# Altium schematic sheet 2XSFP_Arria10.SchDoc: 2 x SFP
size B; DocumentNumber: 18; SheetNumber: 18; SheetTotal: 46
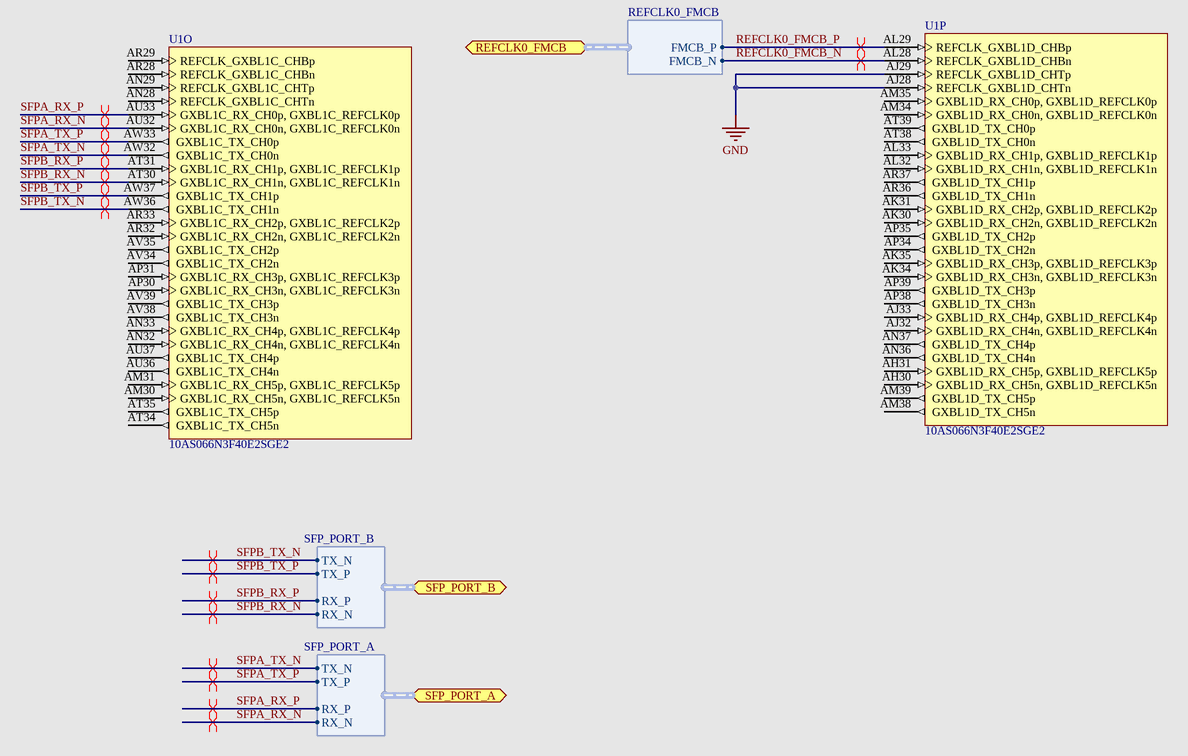
[diagram p0: 2XSFP_Arria10.SchDoc]

## Parts
U1  10AS066N3F40E2SGE2  [ALTR-FBGA1517_A-350]  (parts O,P of 31)

## Ports
REFCLK0_FMCB (harness REFCLK0_FMCB), SFP_PORT_A (harness SFP_PORT_A), SFP_PORT_B (harness SFP_PORT_B)

## Harnesses
REFCLK0_FMCB: FMCB_P, FMCB_N
SFP_PORT_B: TX_P, TX_N, RX_P, RX_N
SFP_PORT_A: TX_P, TX_N, RX_P, RX_N

## Nets
GND: U1.AJ28(REFCLK_GXBL1D_CHTn) U1.AJ29(REFCLK_GXBL1D_CHTp)
REFCLK0_FMCB_N: U1.AL28(REFCLK_GXBL1D_CHBn) ; port REFCLK0_FMCB.FMCB_N
REFCLK0_FMCB_P: U1.AL29(REFCLK_GXBL1D_CHBp) ; port REFCLK0_FMCB.FMCB_P
SFPA_RX_N: U1.AU32(GXBL1C_RX_CH0n,_GXBL1C_REFCLK0n) ; port SFP_PORT_A.RX_N
SFPA_RX_P: U1.AU33(GXBL1C_RX_CH0p,_GXBL1C_REFCLK0p) ; port SFP_PORT_A.RX_P
SFPA_TX_N: U1.AW32(GXBL1C_TX_CH0n) ; port SFP_PORT_A.TX_N
SFPA_TX_P: U1.AW33(GXBL1C_TX_CH0p) ; port SFP_PORT_A.TX_P
SFPB_RX_N: U1.AT30(GXBL1C_RX_CH1n,_GXBL1C_REFCLK1n) ; port SFP_PORT_B.RX_N
SFPB_RX_P: U1.AT31(GXBL1C_RX_CH1p,_GXBL1C_REFCLK1p) ; port SFP_PORT_B.RX_P
SFPB_TX_N: U1.AW36(GXBL1C_TX_CH1n) ; port SFP_PORT_B.TX_N
SFPB_TX_P: U1.AW37(GXBL1C_TX_CH1p) ; port SFP_PORT_B.TX_P

Not connected (* = marked no-connect by the designer): U1 AH30(GXBL1D_RX_CH5n,_GXBL1D_REFCLK5n) AH31(GXBL1D_RX_CH5p,_GXBL1D_REFCLK5p) AJ32(GXBL1D_RX_CH4n,_GXBL1D_REFCLK4n) AJ33(GXBL1D_RX_CH4p,_GXBL1D_REFCLK4p) AK30(GXBL1D_RX_CH2n,_GXBL1D_REFCLK2n) AK31(GXBL1D_RX_CH2p,_GXBL1D_REFCLK2p) AK34(GXBL1D_RX_CH3n,_GXBL1D_REFCLK3n) AK35(GXBL1D_RX_CH3p,_GXBL1D_REFCLK3p) AL32(GXBL1D_RX_CH1n,_GXBL1D_REFCLK1n) AL33(GXBL1D_RX_CH1p,_GXBL1D_REFCLK1p) AM30(GXBL1C_RX_CH5n,_GXBL1C_REFCLK5n) AM31(GXBL1C_RX_CH5p,_GXBL1C_REFCLK5p) AM34(GXBL1D_RX_CH0n,_GXBL1D_REFCLK0n) AM35(GXBL1D_RX_CH0p,_GXBL1D_REFCLK0p) AM38(GXBL1D_TX_CH5n) AM39(GXBL1D_TX_CH5p) AN28(REFCLK_GXBL1C_CHTn) AN29(REFCLK_GXBL1C_CHTp) AN32(GXBL1C_RX_CH4n,_GXBL1C_REFCLK4n) AN33(GXBL1C_RX_CH4p,_GXBL1C_REFCLK4p) AN36(GXBL1D_TX_CH4n) AN37(GXBL1D_TX_CH4p) AP30(GXBL1C_RX_CH3n,_GXBL1C_REFCLK3n) AP31(GXBL1C_RX_CH3p,_GXBL1C_REFCLK3p) AP34(GXBL1D_TX_CH2n) AP35(GXBL1D_TX_CH2p) AP38(GXBL1D_TX_CH3n) AP39(GXBL1D_TX_CH3p) AR28(REFCLK_GXBL1C_CHBn) AR29(REFCLK_GXBL1C_CHBp) AR32(GXBL1C_RX_CH2n,_GXBL1C_REFCLK2n) AR33(GXBL1C_RX_CH2p,_GXBL1C_REFCLK2p) AR36(GXBL1D_TX_CH1n) AR37(GXBL1D_TX_CH1p) AT34(GXBL1C_TX_CH5n) AT35(GXBL1C_TX_CH5p) AT38(GXBL1D_TX_CH0n) AT39(GXBL1D_TX_CH0p) AU36(GXBL1C_TX_CH4n) AU37(GXBL1C_TX_CH4p) AV34(GXBL1C_TX_CH2n) AV35(GXBL1C_TX_CH2p) AV38(GXBL1C_TX_CH3n) AV39(GXBL1C_TX_CH3p)

## Layout directives
differential pair: REFCLK0_FMCB_N, REFCLK0_FMCB_P, SFPA_RX_N, SFPA_RX_P, SFPA_TX_N, SFPA_TX_P, SFPB_RX_N, SFPB_RX_P, SFPB_TX_N, SFPB_TX_P

## Notes on the sheet
- Title
- Size:
- Date:
- B
- Number:
- Time:
- Revision:
- Sheet
- of
- File:

## Library data of the parts
U1 = CMP-1689-00006-3: Arria 10 SX Family, 588 I/O Pins, 16 Fractional PLLs, 1517-Pin FBGA, Speed Grade 2, Extended Grade, RoHS; ComponentLink3Description: Package Specification; PackageVersion: Rev. 5.0, 01/2016; ComponentLink3URL: https://www.altera.com/content/dam/altera-www/global/en_US/pdfs/literature/packaging/04r00461-04.pdf; ComponentLink2Description: Datasheet; Code_JEDEC: MS-034; Mounting Technology: Surface Mount; PartNumber: 10AS066N3F40E2SGE2; PackageDescription: 1517-Pin FineLine Ball-Grid Array (FBGA), Body 40 x 40 mm, Pitch 1 mm; ComponentLink2URL: https://www.altera.com/content/dam/altera-www/global/en_US/pdfs/literature/hb/arria-10/a10_datasheet.pdf; ComponentLink1URL: https://www.altera.com/; DatasheetVersion: Rev. 2016-06-24, 06/2016; ComponentLink1Description: Manufacturer URL